# Altium schematic sheet Sheet1___VL53L0X.SchDoc
size B
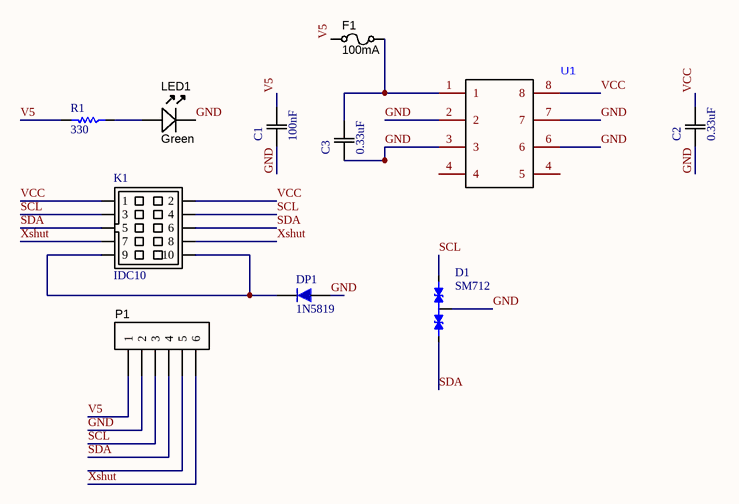
[diagram p0: Sheet1___VL53L0X.SchDoc]

## Parts
C1  100nF  [0805]
C2  0.33uF  [0805]
C3  0.33uF  [0805]
D1  SM712  [psm712]
DP1  1N5819  [430X270D]
F1  value 100mA  [RESC3216X70N]  (hidden comment: Slow-blow)
K1  IDC10  [IDC10-B]
LED1  Color: Green  [LED-0805-K]
P1  Header 6pin  [HDR1X6]  (value not drawn)  (no BOM)
R1  330  [RES 0805 (2012X06L)]
U1  (no value)  [78L05CD15V5V_LIB]

## Nets
GND: C1.1(C1) C2.1(C1) C3.1(C1) D1.3 DP1.1 LED1.K P1.2 U1.2 U1.3 U1.6 U1.7
SCL: D1.1 K1.3 K1.4 P1.3
SDA: D1.2 K1.5 K1.6 P1.4
V5: C1.2(C2) F1.2 P1.1 R1.2
VCC: C2.2(C2) K1.1 K1.2 U1.8
Xshut: K1.7 K1.8 P1.6
NetC3_2: C3.2(C2) F1.1 U1.1
NetDP1_2: DP1.2 K1.9 K1.10
NetLED1_A: LED1.A R1.1

Not connected (* = marked no-connect by the designer): P1 5; U1 4

## Library data of the parts
C1-C3 = CAP 470nF 50V: CAP CER 0.1UF 50V X7R 0805; Value: 470nF; Tolerance: 10%; Package: 0805; Rating: 50V
D1 = SM712.TC: Asymmetrical TVS Diode for  Extended Common-Mode RS-485; Manufacturer: SEMTECH; Link to Datasheet: *; Link to Picture: *; Operating Temp: -55 to 125 °C; Storage Temp: -55 to 150 °C; ComponentLink1Description: *; ComponentLink1URL: *; Manufacture Part #: SM712.TC; Value: SM712
DP1 = 1N5819: Schottkey Rectifiers; Designer: Abbas Basereh; Data: 16-12-2016; Link: *; Part. No: *
F1 = FUSE_160mA_1206: Fuse 160mA 63VDC 1206 SMD; Manufacturer 1: Holly Fuse; Manufacturer Part Number 1: 12T-0160L; Ratings: 160mA; 63VDC; slow-blow; SCDType: spec; Package / Case: 1206 (3216 metric)
K1 = IDC10: BOXHEADER 10 PIN; Manufacturer: Assmann Electronics Inc; Manufacturer Part Number: AWHW10G-0202-T-R; Connector Type: Header, Shrouded; Number of Positions: 10; Number of Positions Loaded: All; Pitch: 0.100" (2.54mm); Supplier 1: Digi-Key; Supplier Part Number 1: HRP10H-ND; Supplier: Digi-Key; Contact Type: Male Pin; RoHS: RoHS Compliant; Supplier Part Number: HRP10H-ND; Category: Connectors, Interconnects; Number of Rows: 2; Row Spacing: 0.100" (2.54mm); Contact Mating Length: -; Mounting Type: Through Hole; Termination: Solder; Fastening Type: -; Features: -; Contact Finish: Gold; Contact Finish Thickness: Flash; Color: Gray; Packaging: Tray
LED1 = LED_SMD_Green_0805_6mcd: LED, 0805 SMD, Green; Manufacturer 1: LITE-ON; Manufacturer Part Number 1: LTST-C171GKT; Material: GaP; Ratings: 6 mcd; 569 nm; SCDType: source; Package / Case: 0805; Supplier 1: Digi-Key; Supplier Part Number 1: 160-1423-1-ND; Value: Green
P1 = Header6P: Header, 6-pin
R1 = Resistor: Tolerance: 5%; Power: 1/8 W; Value: 330
U1 = MC78L05ACDG 5V Regulator